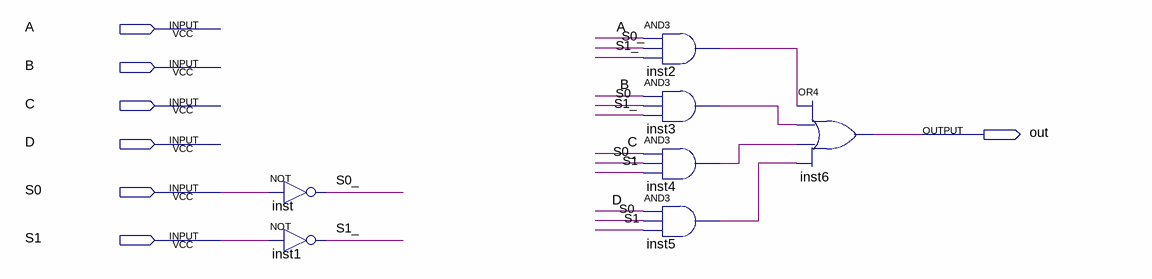
[diagram p0: schematic sheet]
// Quartus schematic 4to1.bdf as structural Verilog: 7 symbols, 7 pins
module \4to1  (
  input  A,
  input  B,
  input  C,
  input  D,
  input  S0,
  input  S1,
  output out
);

  wire inst2_out, inst3_out, inst4_out, inst5_out, S0_, S1_;

  not inst (S0_, S0);
  not inst1 (S1_, S1);
  and inst2 (inst2_out, A, S0_, S1_);
  and inst3 (inst3_out, B, S0, S1_);
  and inst4 (inst4_out, C, S0_, S1);
  and inst5 (inst5_out, D, S0, S1);
  or inst6 (out, inst2_out, inst3_out, inst4_out, inst5_out);
endmodule
